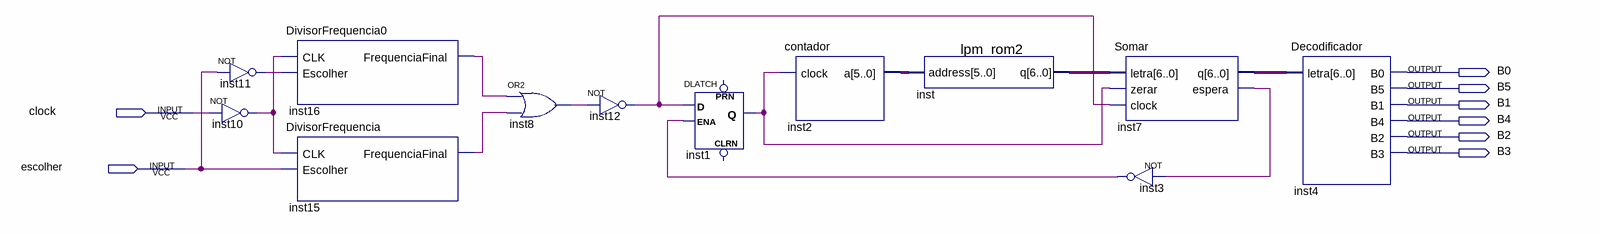
[diagram p0: schematic sheet]
// Quartus schematic pbl2.bdf as structural Verilog: 12 symbols, 8 pins
module pbl2 (
  input  clock,
  input  escolher,
  output B0,
  output B5,
  output B1,
  output B4,
  output B2,
  output B3
);

  wire inst1_q, inst3_out, inst7_espera, inst8_out, inst10_out, inst11_out, inst12_out,
       inst15_frequenciafinal, inst16_frequenciafinal;
  wire [5:0] inst2_a;
  wire [6:0] inst7_q, inst_q;

  not inst11 (inst11_out, escolher);
  not inst10 (inst10_out, clock);
  DivisorFrequencia0 inst16 (.CLK(inst10_out), .Escolher(inst11_out), .FrequenciaFinal(inst16_frequenciafinal));
  DivisorFrequencia inst15 (.CLK(inst10_out), .Escolher(escolher), .FrequenciaFinal(inst15_frequenciafinal));
  or inst8 (inst8_out, inst16_frequenciafinal, inst15_frequenciafinal);
  not inst12 (inst12_out, inst8_out);
  DLATCH inst1 (.D(inst12_out), .ENA(inst3_out), .Q(inst1_q));  // open: CLRN, PRN
  contador inst2 (.clock(inst1_q), .a(inst2_a));
  lpm_rom2 inst (.address(inst2_a), .q(inst_q));
  Somar inst7 (.letra(inst_q), .zerar(inst1_q), .clock(inst12_out), .q(inst7_q), .espera(inst7_espera));
  not inst3 (inst3_out, inst7_espera);
  Decodificador inst4 (.letra(inst7_q), .B0(B0), .B5(B5), .B1(B1), .B4(B4), .B2(B2), .B3(B3));
endmodule
